# Altium schematic sheet IsoPowerSupply.SchDoc
size A4; SheetNumber: 2; SheetTotal: 3; Schematic: Power Supply
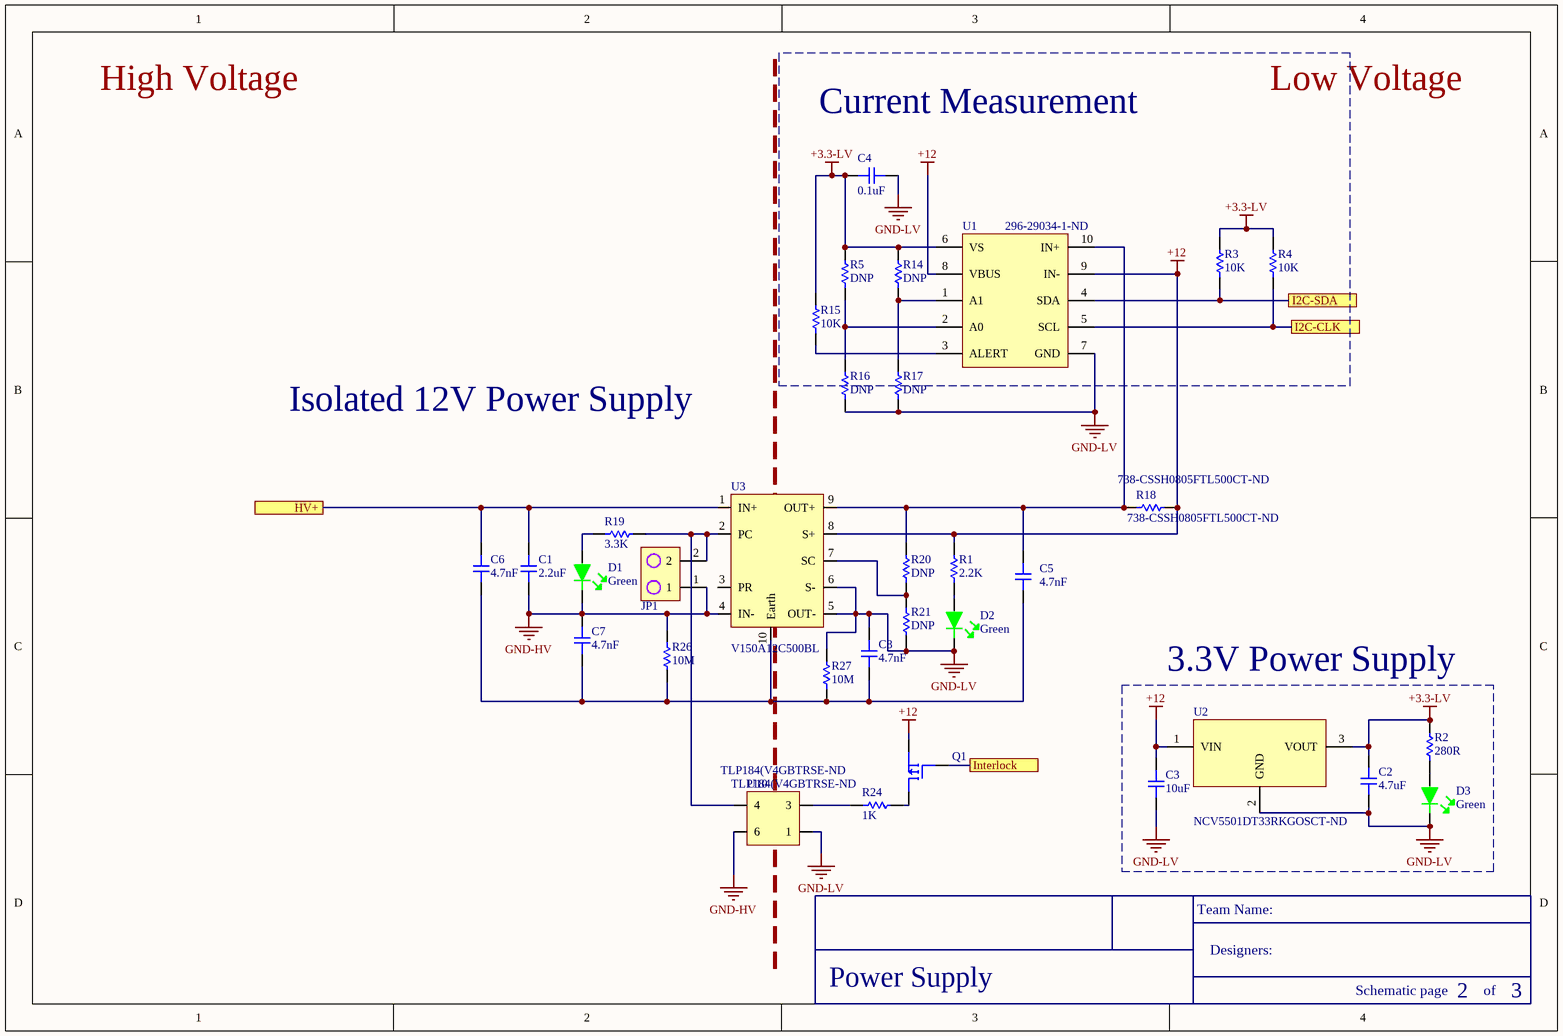
[diagram p0: IsoPowerSupply.SchDoc]

## Parts
C1  2.2uF  [CAP-2220]
C2  4.7uF  [CAP-0805]
C3  10uF  [CAP-1206]
C4  0.1uF  [CAP-0805]
C5  4.7nF  [CAP-0805]
C6  4.7nF  [CAP-0805]
C7  4.7nF  [CAP-0805]
C8  4.7nF  [CAP-0805]
D1  Green  [LED-0603]
D2  Green  [LED-0603]
D3  Green  [LED-0603]
JP1  732-5315-ND  [2PIN-JP]  (value not drawn)
Q1  448-ISS17EP06LMXTSA1CT-ND  [SOT-23-3]  (value not drawn)
R1  2.2K  [RES-0805]
R2  280R  [RES-0805]
R3  10K  [RES-0805]
R4  10K  [RES-0805]
R5  DNP  [RES-0805]
R14  DNP  [RES-0805]
R15  10K  [RES-0805]
R16  DNP  [RES-0805]
R17  DNP  [RES-0805]
R18  738-CSSH0805FTL500CT-ND  [RES-0805]
R19  3.3K  [RES-0805]
R20  DNP  [RES-0805]
R21  DNP  [RES-0805]
R24  1K  [RES-0805]
R26  10M  [RES-0805]
R27  10M  [RES-0805]
U1  296-29034-1-ND  [10MSOP]
U2  NCV5501DT33RKGOSCT-ND  [DPAK-TO252]
U3  V150A12C500BL  [DCDC-200V-12V-500W]
U10  TLP184(V4GBTRSE-ND  [Photocoupler]

## Blocks framed on the sheet
Current Measurement: C4 R3-R5 R14-R17 U1
3.3V Power Supply: C2 C3 D3 R2 U2

## Ports
HV+, I2C-CLK, I2C-SDA, Interlock

## Nets
+3.3-LV: C2.2 C4.1 R2.2 R3.2 R4.2 R5.2 R14.2 R15.2 U1.6(VS) U2.3(VOUT)
+12: C3.2 Q1.2 R1.2 R18.2 U1.8(VBUS) U1.9(IN-) U2.1(VIN) U3.8(S+)
GND-HV: C1.1 C7.2 D1.2 JP1.1 R26.1 U3.4(IN-) U10.6
GND-LV: C2.1 C3.1 C4.2 C8.2 D2.2 D3.2 R16.1 R17.1 R21.2 R27.2 U1.7(GND) U2.2(GND) U3.5(OUT-) U3.6(S-) U10.1
HV+: C1.2 C6.2 U3.1(IN+) ; port HV+
I2C-CLK: R4.1 U1.5(SCL) ; port I2C-CLK
I2C-SDA: R3.1 U1.4(SDA) ; port I2C-SDA
Interlock: Q1.1 ; port Interlock
NetC5_1: C5.1 C6.1 C7.1 C8.1 R26.2 R27.1 U3.10(Earth)
NetC5_2: C5.2 R18.1 R20.2 U1.10(IN+) U3.9(OUT+)
NetD1_1: D1.1 R19.1
NetD2_1: D2.1 R1.1
NetD3_1: D3.1 R2.1
NetJP1_2: JP1.2 R19.2 U3.2(PC) U10.4
NetQ1_3: Q1.3 R24.2
NetR5_1: R5.1 R16.2 U1.2(A0)
NetR14_1: R14.1 R17.2 U1.1(A1)
NetR15_1: R15.1 U1.3(ALERT)
NetR20_1: R20.1 R21.1 U3.7(SC)
NetR24_1: R24.1 U10.3

Not connected (* = marked no-connect by the designer): U3 3(PR)

## Notes on the sheet
- Isolated 12V Power Supply
- High Voltage
- Low Voltage
- Team Name:
- Designers:
- Schematic page
- of

## Library data of the parts
C1 = 2220-2.2uF-450V: CAP CER 2.2UF 450V X6S 2220; Manufacturer: TDK; Manufacturer Part Number: C5750X6S2W225K250KA; Tolerance: 10%; Supplier 1: Digi-Key; Stock 1: 8149; Pricing 1: 1=3.66, 10=2.957, 100=2.258 (USD); Mount: Surface Mount; Case/Package: 2220; Weight: 0.016932oz; Case Code (Metric): 5750; Case Code (Imperial): 2220; Min Operating Temperature: -55°C; Max Operating Temperature: 105°C; Package Quantity: 1; Capacitance: 2.2uF; Voltage Rating: 450V; Packaging: Tape and Reel; Dielectric: X6S; Termination: SMD/SMT; Voltage Rating (DC): 450V; Length: 5.7mm; Height: 2.5mm; Width: 0.197inch; Thickness: 0.11inch; Depth: 5mm; Radiation Hardening: No; REACH SVHC: No SVHC; Lead Free: Lead Free; ComponentLink1URL: http://product.tdk.com/capacitor/mlcc/en/documents/mlcc_commercial_midvoltage_en.pdf?src-supplier=Avnet+Europe; ComponentLink1Description: http://product.tdk.com/capacitor/mlcc/en/documents/mlcc_commercial_midvoltage_en.pdf?src-supplier=Avnet+Europe; Supplier Part Number 1: 445-7781-6-ND
C2 = 0805-4.7uF-16V: CAP CER 4.7UF 16V X5R 0805; Manufacturer: KEMET; Manufacturer Part Number: C0805C475K4PACTU; Dielectric Material: Ceramic; Tolerance: 10%; Supplier 1: Digi-Key; Stock 1: 96594; Pricing 1: 1=0.24, 10=0.168, 100=0.0951, 500=0.0671, 1000=0.05872 (USD); Mount: Surface Mount; Case/Package: 0805; Min Operating Temperature: -55°C; Max Operating Temperature: 85°C; Capacitance: 4.7uF; Packaging: Tape and Reel; Dielectric: X5R; Voltage: 16V; Termination: SMD/SMT; Voltage Rating (DC): 16V; Length: 2mm; Height: 1.25mm; Depth: 1.25mm; Radiation Hardening: No; Lead Free: Lead Free; ComponentLink1URL: http://capacitoredge.kemet.com/capedge2/DataSheet?pn=C0805C475K4PAC7800&src-supplier=Avnet+Europe; ComponentLink1Description: http://capacitoredge.kemet.com/capedge2/DataSheet?pn=C0805C475K4PAC7800&src-supplier=Avnet+Europe; ComponentLink2URL: https://www.verical.com/server-webapp/html/getDatasheet?partID=319476&src-supplier=Verical; ComponentLink2Description: https://www.verical.com/server-webapp/html/getDatasheet?partID=319476&src-supplier=Verical; Supplier Part Number 1: 399-8101-6-ND
C3 = 1206-10uF-50V: CAP CER 10UF 50V X5R 1206; Manufacturer: Murata; Manufacturer Part Number: GRT31CR61H106ME01L; Tolerance: 20%; Supplier 1: Digi-Key; Stock 1: 247205; Pricing 1: 1=0.5, 10=0.349, 100=0.2092, 500=0.1569, 1000=0.13249 (USD); Mount: Surface Mount; Case/Package: 1206; Case Code (Metric): 3216; Case Code (Imperial): 1206; Min Operating Temperature: -55°C; Max Operating Temperature: 85°C; Packaging: Tape and Reel; Capacitance: 10uF; Voltage Rating: 50V; Length: 0.126inch; Width: 0.063inch; Thickness: 0.071inch; Ratings: AEC-Q200; ComponentLink1URL: http://search.murata.co.jp/Ceramy/image/img/A01X/G101/ENG/GRT31CR61H106ME01-01.pdf?src-supplier=Digi-Key; ComponentLink1Description: http://search.murata.co.jp/Ceramy/image/img/A01X/G101/ENG/GRT31CR61H106ME01-01.pdf?src-supplier=Digi-Key; Supplier Part Number 1: 490-12457-1-ND
C4 = 0805-0.1uF-16V: CAP CER 0.1UF 16V Y5V 0805; Manufacturer: KEMET; Manufacturer Part Number: C0805C104Z4VACTU; Dielectric Material: Ceramic; Capacitance: 100nF; Tolerance: 80%; Supplier 1: Digi-Key; Stock 1: 18565; Pricing 1: 1=0.11, 10=0.081, 100=0.038, 500=0.02664, 1000=0.02205 (USD); Mount: Surface Mount; Case/Package: 0805; Case Code (Metric): 2012; Case Code (Imperial): 0805; Min Operating Temperature: -30°C; Max Operating Temperature: 85°C; Package Quantity: 1; Voltage Rating: 16V; Packaging: Tape and Reel; Voltage Rating (DC): 16V; Dielectric: Y5V; Termination: SMD/SMT; Length: 2mm; Height: 0.78mm; Width: 0.049inch; Thickness: 0.035inch; Lead Pitch: 0.75mm; Depth: 1.25mm; Lead Free: Lead Free; ComponentLink1URL: https://search.kemet.com/component-edge/download/datasheet/C0805C104Z4VACTU.pdf?src-supplier=Digi-Key; ComponentLink1Description: https://search.kemet.com/component-edge/download/datasheet/C0805C104Z4VACTU.pdf?src-supplier=Digi-Key; ComponentLink2URL: https://api.kemet.com/component-edge/download/datasheet/C0805C104Z4VACTU.pdf?src-supplier=Digi-Key; ComponentLink2Description: https://api.kemet.com/component-edge/download/datasheet/C0805C104Z4VACTU.pdf?src-supplier=Digi-Key; ComponentLink3URL: http://www.mouser.com/ds/2/212/KEM_C1005_Y5V_SMD-1101305.pdf?src-supplier=Mouser; ComponentLink3Description: http://www.mouser.com/ds/2/212/KEM_C1005_Y5V_SMD-1101305.pdf?src-supplier=Mouser; ComponentLink4URL: http://components.arrow.com/part/dataview/2091119S8993596N7429?src-supplier=Arrow; ComponentLink4Description: http://components.arrow.com/part/dataview/2091119S8993596N7429?src-supplier=Arrow; Supplier Part Number 1: 399-9159-6-ND
C5-C8 = 0805-4.7nF-250V: CAP CER 4700PF 250V X7R 0805; Supplier 1: Digi-Key; Supplier Part Number 1: 490-5593-1-ND
D1-D3 = LED-Green: LED GREEN CLEAR 0603 SMD; Manufacturer: Wurth Electronics; Manufacturer Part Number: 150060VS75000; Luminous Intensity: 40mcd; Viewing Angle: 140°; Forward Voltage: 2V; Wavelength: 570nm; Lens Style: Clear,Rectangular; Forward Current: 30mA; Test Current: 20mA; Supplier 1: Digi-Key; Stock 1: 118118; Pricing 1: 1=0.14, 50=0.133, 100=0.114, 500=0.099 (USD); Mount: Surface Mount; Case/Package: 0603; Number of Pins: 2; Color: Green; Case Code (Metric): 1608; Case Code (Imperial): 0603; Min Operating Temperature: -40°C; Max Operating Temperature: 85°C; Package Quantity: 1; Packaging: Tape and Reel; Dominant Wavelength: 570nm; Length: 1.6mm; Height: 0.7mm; Width: 0.8mm; REACH SVHC: Unknown; ComponentLink1URL: https://katalog.we-online.de/led/datasheet/150060VS75000.pdf?src-supplier=Digi-Key; ComponentLink1Description: https://katalog.we-online.de/led/datasheet/150060VS75000.pdf?src-supplier=Digi-Key; Supplier Part Number 1: 732-4980-1-ND
JP1 = 2PIN-TEST: CONN HEADER VERT 2POS 2.54MM
Q1 = P-FET-60V-0.3A: MOSFET P-CH 60V 300MA SOT23-3; Manufacturer: ON Semiconductor; On-State Resistance: 1.7R; Supplier 1: Digi-Key; Manufacturer Part Number: ISS17EP06LMXTSA1; Stock 1: 141691; Pricing 1: 1=0.25, 10=0.205, 25=0.172, 100=0.084, 250=0.08272, 500=0.0701, 1000=0.04871, 2500=0.04527, 5000=0.03916 (USD); Case/Package: SOT-23-3; Number of Pins: 3; Min Operating Temperature: -55°C; Max Operating Temperature: 150°C; ComponentLink1URL: http://www.onsemi.com/pub/Collateral/BSS138LT1-D.PDF?src-supplier=Digi-Key; ComponentLink1Description: http://www.onsemi.com/pub/Collateral/BSS138LT1-D.PDF?src-supplier=Digi-Key; ComponentLink2URL: http://www.farnell.com/datasheets/2353875.pdf?src-supplier=Element14; ComponentLink2Description: http://www.farnell.com/datasheets/2353875.pdf?src-supplier=Element14; ComponentLink3URL: http://www.onsemi.com/pub_link/Collateral/BSS138LT1-D.PDF?src-supplier=Avnet; ComponentLink3Description: http://www.onsemi.com/pub_link/Collateral/BSS138LT1-D.PDF?src-supplier=Avnet; ComponentLink4URL: https://www.verical.com/server-webapp/html/getDatasheet?partID=141721&src-supplier=Verical; ComponentLink4Description: https://www.verical.com/server-webapp/html/getDatasheet?partID=141721&src-supplier=Verical; ComponentLink5URL: http://www.onsemi.com/pub_link/Collateral/BSS138LT1-D.PDF?src-supplier=Future+Electronics; ComponentLink5Description: http://www.onsemi.com/pub_link/Collateral/BSS138LT1-D.PDF?src-supplier=Future+Electronics; Supplier Part Number 1: 448-ISS17EP06LMXTSA1CT-ND
R1 = 0805-2.2KR: RES SMD 2.2K OHM 1% 1/8W 0805; Manufacturer: Yageo; Manufacturer Part Number: RC0805FR-072K2L; Power Rating: 125mW; Resistance: 2.2kR; Temperature Coefficient: 100ppm/°C; Voltage Rating: 150V; Supplier 1: Digi-Key; Stock 1: 4156138; Pricing 1: 1=0.1, 10=0.04, 100=0.0163, 1000=0.00731, 2500=0.00635 (USD); Case/Package: 0805; Number of Pins: 2; Case Code (Imperial): 0805; Case Code (Metric): 2012; Min Operating Temperature: -55°C; Max Operating Temperature: 155°C; Tolerance: 1%; Packaging: Tape and Reel; Voltage Rating (DC): 150V; Package Quantity: 1; Termination: SMD/SMT; Composition: Thick Film; Number of Terminations: 2; Max Power Dissipation: 125mW; Features: Moisture Resistant; Military Standard: Not; Length: 2mm; Height: 0.5mm; Width: 1.25mm; Depth: 1.25mm; Lead Pitch: 0.4mm; REACH SVHC: Unknown; Lead Free: Lead Free; ComponentLink1URL: http://www.farnell.com/datasheets/38627.pdf?src-supplier=Element14; ComponentLink1Description: http://www.farnell.com/datasheets/38627.pdf?src-supplier=Element14; ComponentLink2URL: http://www.farnell.com/datasheets/444164.pdf?src-supplier=Element14; ComponentLink2Description: http://www.farnell.com/datasheets/444164.pdf?src-supplier=Element14; ComponentLink3URL: http://www.yageo.com/documents/recent/PYu-RC_Group_51_RoHS_L_9.pdf?src-supplier=Digi-Key; ComponentLink3Description: http://www.yageo.com/documents/recent/PYu-RC_Group_51_RoHS_L_9.pdf?src-supplier=Digi-Key; ComponentLink4URL: http://www.yageo.com/documents/recent/PYu-RC_Group_51_RoHS_L_10.pdf?src-supplier=Digi-Key; ComponentLink4Description: http://www.yageo.com/documents/recent/PYu-RC_Group_51_RoHS_L_10.pdf?src-supplier=Digi-Key; Supplier Part Number 1: 311-2.20KCRDKR-ND
R2 = 0805-280R: RES SMD 280 OHM 1% 1/8W 0805; Manufacturer: Yageo; Manufacturer Part Number: RC0805FR-07280RL; Temperature Coefficient: 100ppm/°C; Max Power Dissipation: 125mW; Voltage Rating (DC): 150V; Supplier 1: Digi-Key; Stock 1: 43663; Pricing 1: 1=0.1, 10=0.04, 100=0.0163, 1000=0.00731, 2500=0.00635 (USD); Case/Package: 0805; Case Code (Imperial): 0805; Case Code (Metric): 2012; Min Operating Temperature: -55°C; Max Operating Temperature: 155°C; Package Quantity: 1; Resistance: 280R; Tolerance: 1%; Packaging: Tape and Reel; Composition: Thick Film; Number of Terminations: 2; Features: Moisture Resistant; Power Rating: 125mW; Voltage Rating: 150V; Termination: SMD/SMT; Military Standard: Not; Length: 2mm; Height: 0.024inch; Width: 1.25mm; Depth: 1.25mm; Lead Free: Lead Free; ComponentLink1URL: http://www.yageo.ru/pdf/RC0805.pdf?src-supplier=Mouser; ComponentLink1Description: http://www.yageo.ru/pdf/RC0805.pdf?src-supplier=Mouser; ComponentLink2URL: http://www.yageo.ru/pdf/RC0805.pdf?src-supplier=Future+Electronics; ComponentLink2Description: http://www.yageo.ru/pdf/RC0805.pdf?src-supplier=Future+Electronics; ComponentLink3URL: http://www.yageo.com.tw/exep/pages/download/literatures/PYu-R_INT-thick_7.pdf?src-supplier=Digi-Key; ComponentLink3Description: http://www.yageo.com.tw/exep/pages/download/literatures/PYu-R_INT-thick_7.pdf?src-supplier=Digi-Key; ComponentLink4URL: http://www.yageo.com/documents/recent/PYu-RC_Group_51_RoHS_L_9.pdf?src-supplier=Digi-Key; ComponentLink4Description: http://www.yageo.com/documents/recent/PYu-RC_Group_51_RoHS_L_9.pdf?src-supplier=Digi-Key; Supplier Part Number 1: 311-280CRDKR-ND
R3 R4 R15 = 0805-10KR: RES SMD 10K OHM 1% 1/8W 0805; Manufacturer: Yageo; Manufacturer Part Number: RC0805FR-0710KL; Resistance: 10kR; Temperature Coefficient: 100ppm/°C; Power Rating: 125mW; Voltage Rating: 150V; Supplier 1: Digi-Key; Stock 1: 26112993; Pricing 1: 1=0.1, 10=0.04, 100=0.0163, 1000=0.00731, 2500=0.00635 (USD); Case/Package: 0805; Case Code (Imperial): 0805; Case Code (Metric): 2012; Min Operating Temperature: -55°C; Max Operating Temperature: 155°C; Packaging: Tape and Reel; Tolerance: 1%; Composition: Thick Film; Package Quantity: 1; Termination: SMD/SMT; Number of Terminations: 2; Military Standard: Not; Max Power Dissipation: 125mW; Features: Moisture Resistant; Length: 2mm; Height: 0.024inch; Width: 0.049inch; Depth: 1.25mm; REACH SVHC: Unknown; Lead Free: Lead Free; ComponentLink1URL: http://www.yageo.com/documents/recent/PYu-RC_Group_51_RoHS_L_9.pdf?src-supplier=Mouser; ComponentLink1Description: http://www.yageo.com/documents/recent/PYu-RC_Group_51_RoHS_L_9.pdf?src-supplier=Mouser; ComponentLink2URL: http://www.farnell.com/datasheets/2167052.pdf?src-supplier=Element14; ComponentLink2Description: http://www.farnell.com/datasheets/2167052.pdf?src-supplier=Element14; ComponentLink3URL: http://www.yageo.com/documents/recent/PYu-RC_Group_51_RoHS_L_10.pdf?src-supplier=Digi-Key; ComponentLink3Description: http://www.yageo.com/documents/recent/PYu-RC_Group_51_RoHS_L_10.pdf?src-supplier=Digi-Key; ComponentLink4URL: http://www.yageo.ru/pdf/RC0805.pdf?src-supplier=Future+Electronics; ComponentLink4Description: http://www.yageo.ru/pdf/RC0805.pdf?src-supplier=Future+Electronics; Supplier Part Number 1: 311-10.0KCRCT-ND
R18 = 0805-0.0005R: RES SHUNT, 0805, 0.0005 OHM, 1%,; Supplier 1: Digi-Key; Supplier Part Number 1: 738-CSSH0805FTL500CT-ND
R19 = 0805-3.3KR: RES SMD 3.3K OHM 1% 1/8W 0805; Manufacturer: TE Connectivity; Manufacturer Part Number: CRGCQ0805F3K3; Supplier 1: Digi-Key; Stock 1: 41625; Pricing 1: 1=0.1, 10=0.048, 100=0.0196, 1000=0.00882, 2500=0.00766 (USD); ComponentLink1URL: https://4donline.ihs.com/images/VipMasterIC/IC/TYEL/TYEL-S-A0004929575/TYEL-S-A0004929575-1.pdf?hkey=52A5661711E402568146F3353EA87419&src-supplier=Farnell; ComponentLink1Description: https://4donline.ihs.com/images/VipMasterIC/IC/TYEL/TYEL-S-A0004929575/TYEL-S-A0004929575-1.pdf?hkey=52A5661711E402568146F3353EA87419&src-supplier=Farnell; Supplier Part Number 1: A129755DKR-ND
R24 = 0805-1KR: RES SMD 1K OHM 1% 1/8W 0805; Manufacturer: Yageo; Manufacturer Part Number: RC0805FR-071KL; Resistance: 1kR; Temperature Coefficient: 100ppm/°C; Voltage Rating (DC): 150V; Power Rating: 125mW; Supplier 1: Digi-Key; Stock 1: 21491700; Pricing 1: 1=0.1, 10=0.04, 100=0.0163, 1000=0.00731, 2500=0.00635 (USD); Case/Package: 0805; Number of Pins: 2; Case Code (Metric): 2012; Case Code (Imperial): 0805; Min Operating Temperature: -55°C; Max Operating Temperature: 155°C; Tolerance: 1%; Packaging: Tape and Reel; Composition: Thick Film; Package Quantity: 1; Voltage Rating: 150V; Number of Terminations: 2; Termination: SMD/SMT; Military Standard: Not; Max Power Dissipation: 125mW; Features: Moisture Resistant; Length: 0.079inch; Height: 0.024inch; Width: 0.049inch; Depth: 1.25mm; REACH SVHC: Unknown; Lead Free: Lead Free; ComponentLink1URL: http://www.yageo.com/documents/recent/PYu-RC_Group_51_RoHS_L_10.pdf?src-supplier=Digi-Key; ComponentLink1Description: http://www.yageo.com/documents/recent/PYu-RC_Group_51_RoHS_L_10.pdf?src-supplier=Digi-Key; ComponentLink2URL: http://www.farnell.com/datasheets/1686128.pdf?src-supplier=Element14; ComponentLink2Description: http://www.farnell.com/datasheets/1686128.pdf?src-supplier=Element14; ComponentLink3URL: http://www.yageo.ru/pdf/RC0805.pdf?src-supplier=Future+Electronics; ComponentLink3Description: http://www.yageo.ru/pdf/RC0805.pdf?src-supplier=Future+Electronics; ComponentLink4URL: http://www.farnell.com/datasheets/2167052.pdf?src-supplier=Element14; ComponentLink4Description: http://www.farnell.com/datasheets/2167052.pdf?src-supplier=Element14; Supplier Part Number 1: 311-1.00KCRDKR-ND
R26 R27 = 0805-10MR: RES SMD 10M OHM 1% 1/8W 0805; Supplier Part Number 1: 311-10.0MCRCT-ND; Supplier 1: Digi-Key
U1 = PWR Monitor: IC MONITOR PWR/CURR BIDIR 10MSOP; Manufacturer: Texas Instruments; Manufacturer Part Number: INA226AIDGSR; Min Supply Voltage: 2.7V; Max Supply Voltage: 5.5V; Nominal Supply Current: 330uA; Common Mode Rejection Ratio: 140dB; Output Current: 10mA; Input Bias Current: 10uA; Input Offset Voltage (Vos): 2.5uV; Accuracy: 0.02%; Supplier 1: Digi-Key; Stock 1: 12662; Pricing 1: 1=3.18, 10=2.856, 25=2.7, 100=2.22, 250=1.992, 500=1.92, 1000=1.596 (USD); Mount: Surface Mount; Case/Package: VSSOP; Number of Pins: 10; Contact Plating: Gold; Min Operating Temperature: -40°C; Max Operating Temperature: 125°C; Packaging: Tape and Reel; Package Quantity: 1; Radiation Hardening: No; REACH SVHC: No SVHC; Lead Free: Lead Free; ComponentLink1URL: http://www.ti.com/lit/ds/symlink/ina226.pdf?src-supplier=Digi-Key; ComponentLink1Description: http://www.ti.com/lit/ds/symlink/ina226.pdf?src-supplier=Digi-Key; ComponentLink2URL: http://www.ti.com/general/docs/lit/getliterature.tsp?genericPartNumber=INA226&&fileType=pdf&src-supplier=Avnet; ComponentLink2Description: http://www.ti.com/general/docs/lit/getliterature.tsp?genericPartNumber=INA226&&fileType=pdf&src-supplier=Avnet; ComponentLink3URL: http://www.ti.com/lit/gpn/ina226?src-supplier=Mouser; ComponentLink3Description: http://www.ti.com/lit/gpn/ina226?src-supplier=Mouser; ComponentLink4URL: http://www.farnell.com/datasheets/1840205.pdf?src-supplier=Element14; ComponentLink4Description: http://www.farnell.com/datasheets/1840205.pdf?src-supplier=Element14; Supplier Part Number 1: 296-29034-1-ND
U2 = LDO-3.3V-500mA: IC REG LINEAR 3.3V 500MA DPAK; Manufacturer: ON Semiconductor; Min Input Voltage: 2.5V; Number of Outputs: 1; Max Input Voltage: 16V; Dropout Voltage: 230mV; Polarity: Positive; Accuracy: 2.9%; Output Type: Fixed; Supplier 1: Digi-Key; Manufacturer Part Number: NCV5501DT33RKG; Stock 1: 921; Pricing 1: 1=0.8, 10=0.7, 25=0.6576, 100=0.4984, 250=0.4242, 500=0.403, 1000=0.30755 (USD); Mount: Surface Mount; Case/Package: DPAK; Number of Pins: 3; Contact Plating: Tin,Matte; Min Operating Temperature: -40°C; Max Operating Temperature: 125°C; Output Voltage: 3.3V; Output Current: 500mA; Packaging: Tape and Reel; Max Output Current: 500mA; Package Quantity: 1; Number of Regulators: 1; Min Current Limit: 500mA; Min Output Voltage: 3.3V; Nominal Output Voltage: 3.3V; Output Voltage Accuracy: 2.9%; Length: 6.73mm; Height: 2.38mm; Width: 6.22mm; Radiation Hardening: No; REACH SVHC: No SVHC; Lead Free: Lead Free; ComponentLink1URL: http://www.onsemi.com/pub_link/Collateral/NCP5500-D.PDF?src-supplier=Future+Electronics; ComponentLink1Description: http://www.onsemi.com/pub_link/Collateral/NCP5500-D.PDF?src-supplier=Future+Electronics; ComponentLink2URL: http://www.onsemi.cn/pub_link/Collateral/NCP5500-D.PDF?src-supplier=Avnet; ComponentLink2Description: http://www.onsemi.cn/pub_link/Collateral/NCP5500-D.PDF?src-supplier=Avnet; ComponentLink3URL: http://www.onsemi.com/pub/Collateral/NCP5500-D.PDF?src-supplier=Avnet; ComponentLink3Description: http://www.onsemi.com/pub/Collateral/NCP5500-D.PDF?src-supplier=Avnet; ComponentLink4URL: http://www.onsemi.com/pub/Collateral/NCP5500-D.PDF?src-supplier=Digi-Key; ComponentLink4Description: http://www.onsemi.com/pub/Collateral/NCP5500-D.PDF?src-supplier=Digi-Key; Supplier Part Number 1: NCV5501DT33RKGOSDKR-ND
U3 = DCDC200V-12V: DC DC CONVERTER 12V 500W; Manufacturer: Vicor; Number of Outputs: 1; Efficiency: 87.6%; Min Input Voltage: 100V; Max Input Voltage: 200V; Max Output Current: 41.67A; Isolation Voltage: 3kV; Isolation: Isolated; Supplier 1: Digi-Key; Manufacturer Part Number: V150A12C500BL; Stock 1: 3; Pricing 1: 1=313.93, 10=303.804 (USD); Mount: Through Hole; Case/Package: Full Brick; Min Operating Temperature: -20°C; Max Operating Temperature: 100°C; Package Quantity: 1; Packaging: Bulk; Voltage - Output 1: 12V; Max Power Dissipation: 500W; Features: UVLO,OVP; Output Power: 500W; Output Voltage: 12V; Length: 4.6inch; Height: 0.62inch; Width: 2.2inch; Lead Free: Contains Lead; ComponentLink1URL: http://cdn.vicorpower.com/documents/datasheets/ds_150vin-maxi-family.pdf?src-supplier=Future+Electronics; ComponentLink1Description: http://cdn.vicorpower.com/documents/datasheets/ds_150vin-maxi-family.pdf?src-supplier=Future+Electronics; ComponentLink2URL: http://cdn.vicorpower.com/documents/datasheets/ds_150vin-maxi-family.pdf?src-supplier=Digi-Key; ComponentLink2Description: http://cdn.vicorpower.com/documents/datasheets/ds_150vin-maxi-family.pdf?src-supplier=Digi-Key; Supplier Part Number 1: 1102-1229-ND
U10 = Photocoupler: X36 PB-F PHOTOCOUPLER SO6 ROHS T; Supplier 1: Digi-Key; Supplier Part Number 1: TLP184(V4GBTRSE-ND